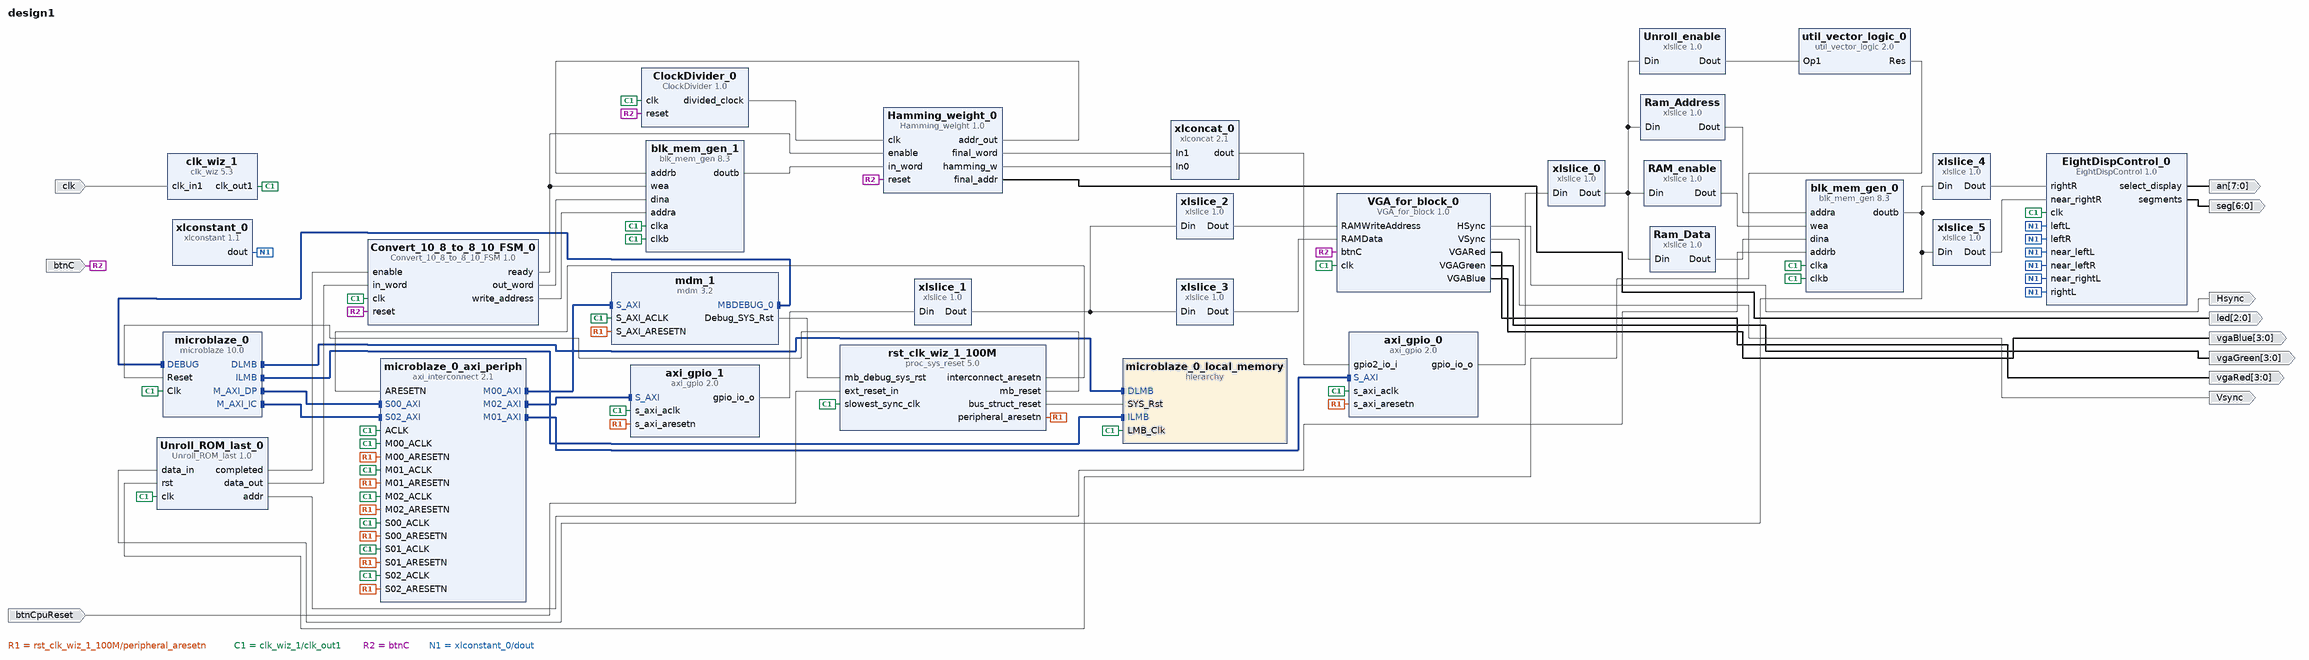
[diagram p0: block diagram of the top level]
# Vivado block design design1, xc7a100tcsg324-1, Vivado 2016.4
create_bd_design design1

create_bd_port -dir I clk
create_bd_port -dir I btnCpuReset
create_bd_port -dir I btnC
create_bd_port -dir O -from 7 -to 0 an
create_bd_port -dir O -from 6 -to 0 seg
create_bd_port -dir O -from 2 -to 0 led
create_bd_port -dir O Hsync
create_bd_port -dir O Vsync
create_bd_port -dir O -from 3 -to 0 vgaRed
create_bd_port -dir O -from 3 -to 0 vgaGreen
create_bd_port -dir O -from 3 -to 0 vgaBlue

create_bd_cell -type ip -vlnv xilinx.com:ip:microblaze:10.0 microblaze_0
set_property -dict [list \
  CONFIG.C_D_AXI 1 \
  CONFIG.C_D_LMB 1 \
  CONFIG.C_I_LMB 1 \
  CONFIG.C_USE_BARREL 1 \
  CONFIG.C_USE_DIV 1 \
  CONFIG.C_USE_HW_MUL 2 \
  CONFIG.C_USE_FPU 1 \
  CONFIG.C_DEBUG_ENABLED 1 \
  CONFIG.C_USE_ICACHE 1 \
  CONFIG.C_CACHE_BYTE_SIZE 4096 \
  CONFIG.C_USE_DCACHE 0 \
] [get_bd_cells microblaze_0]
create_bd_cell -type hier microblaze_0_local_memory
create_bd_cell -type ip -vlnv xilinx.com:ip:axi_interconnect:2.1 microblaze_0_axi_periph
set_property -dict {CONFIG.NUM_SI 3 CONFIG.NUM_MI 3} [get_bd_cells microblaze_0_axi_periph]
create_bd_cell -type ip -vlnv xilinx.com:ip:mdm:3.2 mdm_1
set_property -dict {CONFIG.C_USE_UART 1} [get_bd_cells mdm_1]
create_bd_cell -type ip -vlnv xilinx.com:ip:clk_wiz:5.3 clk_wiz_1
set_property -dict [list \
  CONFIG.PRIM_SOURCE Single_ended_clock_capable_pin \
  CONFIG.USE_LOCKED false \
  CONFIG.USE_RESET false \
] [get_bd_cells clk_wiz_1]
create_bd_cell -type ip -vlnv xilinx.com:ip:proc_sys_reset:5.0 rst_clk_wiz_1_100M
create_bd_cell -type ip -vlnv xilinx.com:ip:axi_gpio:2.0 axi_gpio_0
set_property -dict [list \
  CONFIG.C_IS_DUAL 1 \
  CONFIG.C_ALL_INPUTS 0 \
  CONFIG.C_ALL_INPUTS_2 1 \
  CONFIG.C_ALL_OUTPUTS 1 \
] [get_bd_cells axi_gpio_0]
create_bd_cell -type ip -vlnv xilinx.com:ip:blk_mem_gen:8.3 blk_mem_gen_0
set_property -dict [list \
  CONFIG.Memory_Type Simple_Dual_Port_RAM \
  CONFIG.Enable_32bit_Address false \
  CONFIG.Use_Byte_Write_Enable false \
  CONFIG.Write_Width_A 8 \
  CONFIG.Operating_Mode_A WRITE_FIRST \
  CONFIG.Enable_A Always_Enabled \
  CONFIG.Write_Width_B 8 \
  CONFIG.Read_Width_B 8 \
  CONFIG.Enable_B Always_Enabled \
  CONFIG.Register_PortB_Output_of_Memory_Primitives false \
  CONFIG.Port_A_Write_Rate 50 \
  CONFIG.Port_B_Clock 100 \
  CONFIG.Port_B_Enable_Rate 100 \
  CONFIG.use_bram_block Stand_Alone \
] [get_bd_cells blk_mem_gen_0]
create_bd_cell -type ip -vlnv xilinx.com:ip:xlslice:1.0 xlslice_0
set_property -dict {CONFIG.DOUT_WIDTH 16 CONFIG.DIN_FROM 15} [get_bd_cells xlslice_0]
create_bd_cell -type ip -vlnv xilinx.com:ip:xlslice:1.0 Ram_Address
set_property -dict {CONFIG.DOUT_WIDTH 4 CONFIG.DIN_TO 8 CONFIG.DIN_FROM 11 CONFIG.DIN_WIDTH 16} [get_bd_cells Ram_Address]
create_bd_cell -type ip -vlnv xilinx.com:ip:xlslice:1.0 Ram_Data
set_property -dict {CONFIG.DOUT_WIDTH 8 CONFIG.DIN_TO 0 CONFIG.DIN_FROM 7 CONFIG.DIN_WIDTH 16} [get_bd_cells Ram_Data]
create_bd_cell -type ip -vlnv xilinx.com:ip:xlslice:1.0 RAM_enable
set_property -dict {CONFIG.DOUT_WIDTH 1 CONFIG.DIN_TO 12 CONFIG.DIN_FROM 12 CONFIG.DIN_WIDTH 16} [get_bd_cells RAM_enable]
create_bd_cell -type ip -vlnv xilinx.com:user:ClockDivider:1.0 ClockDivider_0
set_property -dict {CONFIG.division_bits 26} [get_bd_cells ClockDivider_0]
create_bd_cell -type ip -vlnv xilinx.com:ip:xlslice:1.0 Unroll_enable
set_property -dict {CONFIG.DOUT_WIDTH 1 CONFIG.DIN_TO 13 CONFIG.DIN_FROM 13 CONFIG.DIN_WIDTH 16} [get_bd_cells Unroll_enable]
create_bd_cell -type ip -vlnv xilinx.com:ip:util_vector_logic:2.0 util_vector_logic_0
set_property -dict {CONFIG.C_OPERATION not} [get_bd_cells util_vector_logic_0]
create_bd_cell -type ip -vlnv user.org:user:Unroll_ROM_last:1.0 Unroll_ROM_last_0
set_property -dict {CONFIG.data_width 8 CONFIG.depth 10} [get_bd_cells Unroll_ROM_last_0]
create_bd_cell -type ip -vlnv ua.pt:user:EightDispControl:1.0 EightDispControl_0
create_bd_cell -type ip -vlnv xilinx.com:ip:blk_mem_gen:8.3 blk_mem_gen_1
set_property -dict [list \
  CONFIG.Memory_Type Simple_Dual_Port_RAM \
  CONFIG.Enable_32bit_Address false \
  CONFIG.Use_Byte_Write_Enable false \
  CONFIG.Write_Width_A 10 \
  CONFIG.Operating_Mode_A NO_CHANGE \
  CONFIG.Enable_A Always_Enabled \
  CONFIG.Write_Width_B 10 \
  CONFIG.Read_Width_B 10 \
  CONFIG.Enable_B Always_Enabled \
  CONFIG.Register_PortB_Output_of_Memory_Primitives false \
  CONFIG.Port_A_Write_Rate 50 \
  CONFIG.Port_B_Clock 100 \
  CONFIG.Port_B_Enable_Rate 100 \
  CONFIG.use_bram_block Stand_Alone \
] [get_bd_cells blk_mem_gen_1]
create_bd_cell -type ip -vlnv xilinx.com:user:Convert_10_8_to_8_10_FSM:1.0 Convert_10_8_to_8_10_FSM_0
create_bd_cell -type ip -vlnv xilinx.com:user:Hamming_weight:1.0 Hamming_weight_0
create_bd_cell -type ip -vlnv ua.pt:user:VGA_for_block:1.0 VGA_for_block_0
create_bd_cell -type ip -vlnv xilinx.com:ip:xlconcat:2.1 xlconcat_0
create_bd_cell -type ip -vlnv xilinx.com:ip:xlslice:1.0 xlslice_1
set_property -dict {CONFIG.DOUT_WIDTH 21 CONFIG.DIN_FROM 20} [get_bd_cells xlslice_1]
create_bd_cell -type ip -vlnv xilinx.com:ip:xlslice:1.0 xlslice_2
set_property -dict {CONFIG.DOUT_WIDTH 13 CONFIG.DIN_TO 0 CONFIG.DIN_FROM 12 CONFIG.DIN_WIDTH 21} [get_bd_cells xlslice_2]
create_bd_cell -type ip -vlnv xilinx.com:ip:xlslice:1.0 xlslice_3
set_property -dict {CONFIG.DIN_TO 13 CONFIG.DIN_FROM 20 CONFIG.DIN_WIDTH 21} [get_bd_cells xlslice_3]
create_bd_cell -type ip -vlnv xilinx.com:ip:xlconstant:1.1 xlconstant_0
set_property -dict {CONFIG.CONST_WIDTH 4 CONFIG.CONST_VAL 0} [get_bd_cells xlconstant_0]
create_bd_cell -type ip -vlnv xilinx.com:ip:xlslice:1.0 xlslice_4
set_property -dict {CONFIG.DOUT_WIDTH 4 CONFIG.DIN_TO 0 CONFIG.DIN_FROM 3 CONFIG.DIN_WIDTH 8} [get_bd_cells xlslice_4]
create_bd_cell -type ip -vlnv xilinx.com:ip:xlslice:1.0 xlslice_5
set_property -dict {CONFIG.DOUT_WIDTH 4 CONFIG.DIN_TO 4 CONFIG.DIN_FROM 7 CONFIG.DIN_WIDTH 8} [get_bd_cells xlslice_5]
create_bd_cell -type ip -vlnv xilinx.com:ip:axi_gpio:2.0 axi_gpio_1
set_property -dict {CONFIG.C_IS_DUAL 0 CONFIG.C_ALL_INPUTS 0 CONFIG.C_ALL_OUTPUTS 1} [get_bd_cells axi_gpio_1]

# ---- hierarchy /microblaze_0_local_memory ----
current_bd_instance /microblaze_0_local_memory
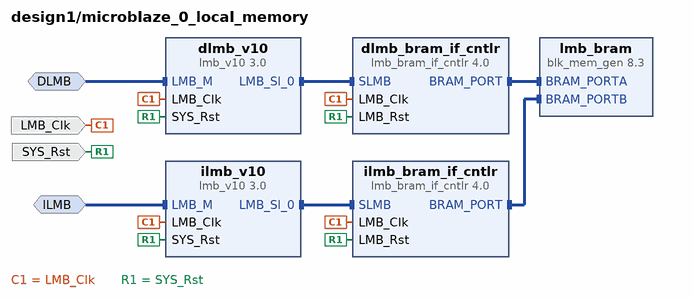
[diagram p1: block diagram inside /microblaze_0_local_memory]
create_bd_intf_pin -mode MirroredMaster -vlnv xilinx.com:interface:lmb_rtl:1.0 DLMB
create_bd_intf_pin -mode MirroredMaster -vlnv xilinx.com:interface:lmb_rtl:1.0 ILMB
create_bd_pin -dir I -type clk LMB_Clk
create_bd_pin -dir I -type rst SYS_Rst

create_bd_cell -type ip -vlnv xilinx.com:ip:lmb_v10:3.0 dlmb_v10
create_bd_cell -type ip -vlnv xilinx.com:ip:lmb_v10:3.0 ilmb_v10
create_bd_cell -type ip -vlnv xilinx.com:ip:lmb_bram_if_cntlr:4.0 dlmb_bram_if_cntlr
set_property -dict {CONFIG.C_ECC 0} [get_bd_cells dlmb_bram_if_cntlr]
create_bd_cell -type ip -vlnv xilinx.com:ip:lmb_bram_if_cntlr:4.0 ilmb_bram_if_cntlr
set_property -dict {CONFIG.C_ECC 0} [get_bd_cells ilmb_bram_if_cntlr]
create_bd_cell -type ip -vlnv xilinx.com:ip:blk_mem_gen:8.3 lmb_bram
set_property -dict {CONFIG.Memory_Type True_Dual_Port_RAM CONFIG.use_bram_block BRAM_Controller} [get_bd_cells lmb_bram]

# ---- connections ----

current_bd_instance /microblaze_0_local_memory
connect_bd_intf_net -intf_net microblaze_0_dlmb_bus [get_bd_intf_pins dlmb_v10/LMB_Sl_0] [get_bd_intf_pins dlmb_bram_if_cntlr/SLMB]
connect_bd_intf_net -intf_net microblaze_0_ilmb_bus [get_bd_intf_pins ilmb_v10/LMB_Sl_0] [get_bd_intf_pins ilmb_bram_if_cntlr/SLMB]
connect_bd_intf_net -intf_net microblaze_0_dlmb_cntlr [get_bd_intf_pins dlmb_bram_if_cntlr/BRAM_PORT] [get_bd_intf_pins lmb_bram/BRAM_PORTA]
connect_bd_intf_net -intf_net microblaze_0_ilmb_cntlr [get_bd_intf_pins ilmb_bram_if_cntlr/BRAM_PORT] [get_bd_intf_pins lmb_bram/BRAM_PORTB]
connect_bd_intf_net -intf_net microblaze_0_dlmb [get_bd_intf_pins DLMB] [get_bd_intf_pins dlmb_v10/LMB_M]
connect_bd_intf_net -intf_net microblaze_0_ilmb [get_bd_intf_pins ILMB] [get_bd_intf_pins ilmb_v10/LMB_M]
connect_bd_net -net microblaze_0_Clk [get_bd_pins LMB_Clk] \
  [get_bd_pins dlmb_v10/LMB_Clk] [get_bd_pins dlmb_bram_if_cntlr/LMB_Clk] [get_bd_pins ilmb_v10/LMB_Clk] \
  [get_bd_pins ilmb_bram_if_cntlr/LMB_Clk]
connect_bd_net [get_bd_pins SYS_Rst] \
  [get_bd_pins dlmb_v10/SYS_Rst] [get_bd_pins dlmb_bram_if_cntlr/LMB_Rst] [get_bd_pins ilmb_v10/SYS_Rst] \
  [get_bd_pins ilmb_bram_if_cntlr/LMB_Rst]

current_bd_instance /
connect_bd_intf_net [get_bd_intf_pins microblaze_0/DLMB] [get_bd_intf_pins microblaze_0_local_memory/DLMB]
connect_bd_intf_net [get_bd_intf_pins microblaze_0/ILMB] [get_bd_intf_pins microblaze_0_local_memory/ILMB]
connect_bd_intf_net -intf_net microblaze_0_axi_dp [get_bd_intf_pins microblaze_0_axi_periph/S00_AXI] [get_bd_intf_pins microblaze_0/M_AXI_DP]
connect_bd_intf_net [get_bd_intf_pins mdm_1/MBDEBUG_0] [get_bd_intf_pins microblaze_0/DEBUG]
connect_bd_intf_net -intf_net microblaze_0_mdm_axi [get_bd_intf_pins microblaze_0_axi_periph/M00_AXI] [get_bd_intf_pins mdm_1/S_AXI]
connect_bd_intf_net [get_bd_intf_pins microblaze_0_axi_periph/M01_AXI] [get_bd_intf_pins axi_gpio_0/S_AXI]
connect_bd_intf_net [get_bd_intf_pins microblaze_0/M_AXI_IC] [get_bd_intf_pins microblaze_0_axi_periph/S02_AXI]
connect_bd_intf_net [get_bd_intf_pins microblaze_0_axi_periph/M02_AXI] [get_bd_intf_pins axi_gpio_1/S_AXI]
connect_bd_net [get_bd_pins rst_clk_wiz_1_100M/mb_reset] [get_bd_pins microblaze_0/Reset]
connect_bd_net [get_bd_pins rst_clk_wiz_1_100M/bus_struct_reset] [get_bd_pins microblaze_0_local_memory/SYS_Rst]
connect_bd_net [get_bd_pins rst_clk_wiz_1_100M/interconnect_aresetn] [get_bd_pins microblaze_0_axi_periph/ARESETN]
connect_bd_net [get_bd_pins rst_clk_wiz_1_100M/peripheral_aresetn] \
  [get_bd_pins mdm_1/S_AXI_ARESETN] [get_bd_pins axi_gpio_0/s_axi_aresetn] [get_bd_pins microblaze_0_axi_periph/S00_ARESETN] \
  [get_bd_pins microblaze_0_axi_periph/M00_ARESETN] [get_bd_pins microblaze_0_axi_periph/M01_ARESETN] \
  [get_bd_pins microblaze_0_axi_periph/M02_ARESETN] [get_bd_pins microblaze_0_axi_periph/S01_ARESETN] \
  [get_bd_pins microblaze_0_axi_periph/S02_ARESETN] [get_bd_pins axi_gpio_1/s_axi_aresetn]
connect_bd_net [get_bd_pins mdm_1/Debug_SYS_Rst] [get_bd_pins rst_clk_wiz_1_100M/mb_debug_sys_rst]
connect_bd_net [get_bd_ports clk] [get_bd_pins clk_wiz_1/clk_in1]
connect_bd_net [get_bd_pins xlslice_0/Dout] \
  [get_bd_pins RAM_enable/Din] [get_bd_pins Ram_Address/Din] [get_bd_pins Ram_Data/Din] [get_bd_pins Unroll_enable/Din]
connect_bd_net -net xlslice_3_Dout [get_bd_pins RAM_enable/Dout] [get_bd_pins blk_mem_gen_0/wea]
connect_bd_net -net xlslice_1_Dout [get_bd_pins Ram_Address/Dout] [get_bd_pins blk_mem_gen_0/addra]
connect_bd_net -net xlslice_2_Dout [get_bd_pins Ram_Data/Dout] [get_bd_pins blk_mem_gen_0/dina]
connect_bd_net [get_bd_ports btnCpuReset] [get_bd_pins rst_clk_wiz_1_100M/ext_reset_in]
connect_bd_net [get_bd_pins clk_wiz_1/clk_out1] \
  [get_bd_pins rst_clk_wiz_1_100M/slowest_sync_clk] [get_bd_pins mdm_1/S_AXI_ACLK] [get_bd_pins microblaze_0/Clk] \
  [get_bd_pins ClockDivider_0/clk] [get_bd_pins axi_gpio_0/s_axi_aclk] [get_bd_pins blk_mem_gen_0/clka] \
  [get_bd_pins blk_mem_gen_0/clkb] [get_bd_pins Unroll_ROM_last_0/clk] [get_bd_pins EightDispControl_0/clk] \
  [get_bd_pins blk_mem_gen_1/clka] [get_bd_pins blk_mem_gen_1/clkb] [get_bd_pins Convert_10_8_to_8_10_FSM_0/clk] \
  [get_bd_pins VGA_for_block_0/clk] [get_bd_pins microblaze_0_local_memory/LMB_Clk] \
  [get_bd_pins microblaze_0_axi_periph/ACLK] [get_bd_pins microblaze_0_axi_periph/S00_ACLK] \
  [get_bd_pins microblaze_0_axi_periph/M00_ACLK] [get_bd_pins microblaze_0_axi_periph/M01_ACLK] \
  [get_bd_pins microblaze_0_axi_periph/M02_ACLK] [get_bd_pins microblaze_0_axi_periph/S01_ACLK] \
  [get_bd_pins microblaze_0_axi_periph/S02_ACLK] [get_bd_pins axi_gpio_1/s_axi_aclk]
connect_bd_net [get_bd_pins blk_mem_gen_0/doutb] [get_bd_pins Unroll_ROM_last_0/data_in] [get_bd_pins xlslice_5/Din] [get_bd_pins xlslice_4/Din]
connect_bd_net [get_bd_pins Unroll_ROM_last_0/addr] [get_bd_pins blk_mem_gen_0/addrb]
connect_bd_net [get_bd_pins Unroll_ROM_last_0/completed] [get_bd_pins Convert_10_8_to_8_10_FSM_0/enable]
connect_bd_net [get_bd_pins axi_gpio_0/gpio_io_o] [get_bd_pins xlslice_0/Din]
connect_bd_net [get_bd_ports btnC] \
  [get_bd_pins ClockDivider_0/reset] [get_bd_pins Hamming_weight_0/reset] [get_bd_pins Convert_10_8_to_8_10_FSM_0/reset] \
  [get_bd_pins VGA_for_block_0/btnC]
connect_bd_net -net xlslice_4_Dout [get_bd_pins Unroll_enable/Dout] [get_bd_pins util_vector_logic_0/Op1]
connect_bd_net [get_bd_pins EightDispControl_0/select_display] [get_bd_ports an]
connect_bd_net [get_bd_pins EightDispControl_0/segments] [get_bd_ports seg]
connect_bd_net [get_bd_pins Convert_10_8_to_8_10_FSM_0/ready] [get_bd_pins blk_mem_gen_1/wea] [get_bd_pins Hamming_weight_0/enable]
connect_bd_net [get_bd_pins Convert_10_8_to_8_10_FSM_0/out_word] [get_bd_pins blk_mem_gen_1/dina]
connect_bd_net [get_bd_pins Convert_10_8_to_8_10_FSM_0/write_address] [get_bd_pins blk_mem_gen_1/addra]
connect_bd_net [get_bd_pins util_vector_logic_0/Res] [get_bd_pins Unroll_ROM_last_0/rst]
connect_bd_net [get_bd_pins Hamming_weight_0/addr_out] [get_bd_pins blk_mem_gen_1/addrb]
connect_bd_net [get_bd_pins blk_mem_gen_1/doutb] [get_bd_pins Hamming_weight_0/in_word]
connect_bd_net [get_bd_pins ClockDivider_0/divided_clock] [get_bd_pins Hamming_weight_0/clk]
connect_bd_net [get_bd_pins Hamming_weight_0/final_addr] [get_bd_ports led]
connect_bd_net [get_bd_pins Hamming_weight_0/final_word] [get_bd_pins xlconcat_0/In1]
connect_bd_net [get_bd_pins Hamming_weight_0/hamming_w] [get_bd_pins xlconcat_0/In0]
connect_bd_net [get_bd_pins VGA_for_block_0/HSync] [get_bd_ports Hsync]
connect_bd_net [get_bd_pins VGA_for_block_0/VSync] [get_bd_ports Vsync]
connect_bd_net [get_bd_pins VGA_for_block_0/VGARed] [get_bd_ports vgaRed]
connect_bd_net [get_bd_pins VGA_for_block_0/VGAGreen] [get_bd_ports vgaGreen]
connect_bd_net [get_bd_pins VGA_for_block_0/VGABlue] [get_bd_ports vgaBlue]
connect_bd_net [get_bd_pins xlslice_1/Dout] [get_bd_pins xlslice_2/Din] [get_bd_pins xlslice_3/Din]
connect_bd_net [get_bd_pins xlslice_3/Dout] [get_bd_pins VGA_for_block_0/RAMData]
connect_bd_net [get_bd_pins xlslice_2/Dout] [get_bd_pins VGA_for_block_0/RAMWriteAddress]
connect_bd_net [get_bd_pins Unroll_ROM_last_0/data_out] [get_bd_pins Convert_10_8_to_8_10_FSM_0/in_word]
connect_bd_net [get_bd_pins xlconstant_0/dout] \
  [get_bd_pins EightDispControl_0/leftL] [get_bd_pins EightDispControl_0/near_leftL] \
  [get_bd_pins EightDispControl_0/near_rightL] [get_bd_pins EightDispControl_0/rightL] [get_bd_pins EightDispControl_0/leftR] \
  [get_bd_pins EightDispControl_0/near_leftR]
connect_bd_net [get_bd_pins xlslice_5/Dout] [get_bd_pins EightDispControl_0/near_rightR]
connect_bd_net [get_bd_pins xlslice_4/Dout] [get_bd_pins EightDispControl_0/rightR]
connect_bd_net [get_bd_pins xlconcat_0/dout] [get_bd_pins axi_gpio_0/gpio2_io_i]
connect_bd_net [get_bd_pins axi_gpio_1/gpio_io_o] [get_bd_pins xlslice_1/Din]

# ---- address map ----
assign_bd_address -offset 0x00000000 -range 128K -target_address_space [get_bd_addr_spaces microblaze_0/Data] [get_bd_addr_segs microblaze_0_local_memory/dlmb_bram_if_cntlr/SLMB/Mem]
assign_bd_address -offset 0x40000000 -range 64K -target_address_space [get_bd_addr_spaces microblaze_0/Data] [get_bd_addr_segs axi_gpio_0/S_AXI/Reg]
assign_bd_address -offset 0x40010000 -range 64K -target_address_space [get_bd_addr_spaces microblaze_0/Data] [get_bd_addr_segs axi_gpio_1/S_AXI/Reg]
assign_bd_address -offset 0x41400000 -range 4K -target_address_space [get_bd_addr_spaces microblaze_0/Data] [get_bd_addr_segs mdm_1/S_AXI/Reg]
assign_bd_address -offset 0x00000000 -range 128K -target_address_space [get_bd_addr_spaces microblaze_0/Instruction] [get_bd_addr_segs microblaze_0_local_memory/ilmb_bram_if_cntlr/SLMB/Mem]
assign_bd_address -offset 0x40000000 -range 64K -target_address_space [get_bd_addr_spaces microblaze_0/Instruction] [get_bd_addr_segs axi_gpio_0/S_AXI/Reg]
assign_bd_address -offset 0x40010000 -range 64K -target_address_space [get_bd_addr_spaces microblaze_0/Instruction] [get_bd_addr_segs axi_gpio_1/S_AXI/Reg]
assign_bd_address -offset 0x41400000 -range 4K -target_address_space [get_bd_addr_spaces microblaze_0/Instruction] [get_bd_addr_segs mdm_1/S_AXI/Reg]

validate_bd_design
save_bd_design
